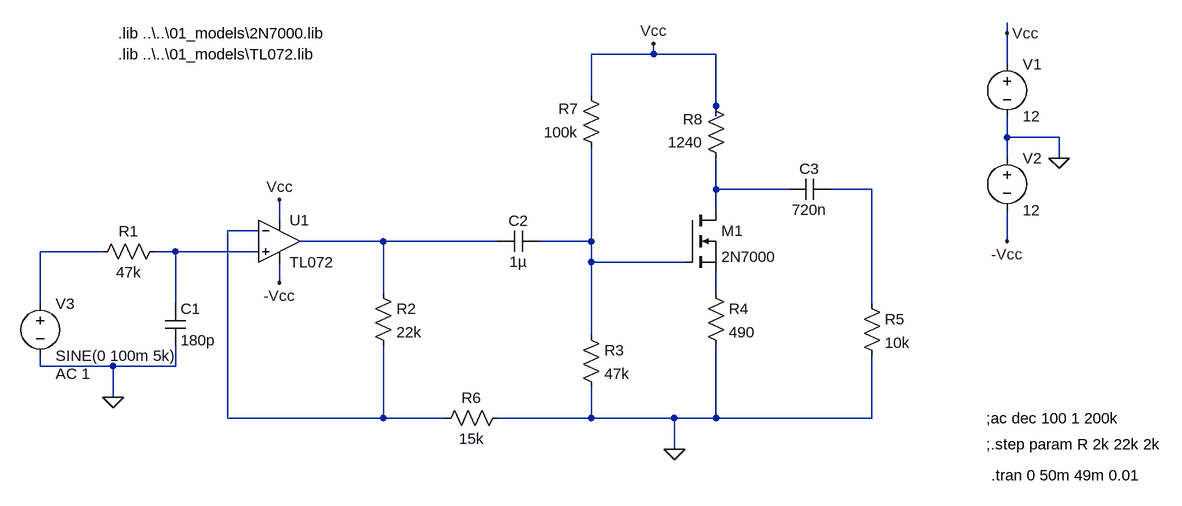
[diagram p0: schematic elec331_commonsourceamplifier.asc]
elec331_commonsourceamplifier.asc, the LTspice schematic file:
Version 4
SHEET 1 1932 884
WIRE 1648 -16 1648 -32
WIRE 1104 16 1104 0
WIRE 1104 16 1008 16
WIRE 1200 16 1104 16
WIRE 1648 32 1648 -16
WIRE 1008 80 1008 16
WIRE 1200 96 1200 16
WIRE 1200 112 1200 96
WIRE 1648 144 1648 112
WIRE 1728 144 1648 144
WIRE 1648 176 1648 144
WIRE 1728 176 1728 144
WIRE 1200 224 1200 176
WIRE 1312 224 1200 224
WIRE 1440 224 1376 224
WIRE 1200 256 1200 224
WIRE 528 272 528 240
WIRE 496 288 448 288
WIRE 688 304 560 304
WIRE 864 304 688 304
WIRE 1008 304 1008 160
WIRE 1008 304 928 304
WIRE 1648 304 1648 256
WIRE 256 320 160 320
WIRE 368 320 336 320
WIRE 496 320 368 320
WIRE 1008 336 1008 304
WIRE 1152 336 1008 336
WIRE 528 368 528 336
WIRE 688 384 688 304
WIRE 1200 384 1200 352
WIRE 160 400 160 320
WIRE 368 400 368 320
WIRE 1440 400 1440 224
WIRE 1008 448 1008 336
WIRE 160 496 160 480
WIRE 272 496 160 496
WIRE 368 496 368 464
WIRE 368 496 272 496
WIRE 272 544 272 496
WIRE 448 576 448 288
WIRE 688 576 688 464
WIRE 688 576 448 576
WIRE 784 576 688 576
WIRE 1008 576 1008 528
WIRE 1008 576 864 576
WIRE 1136 576 1008 576
WIRE 1200 576 1200 464
WIRE 1200 576 1136 576
WIRE 1440 576 1440 480
WIRE 1440 576 1200 576
WIRE 1136 624 1136 576
FLAG 1728 176 0
FLAG 1648 -16 Vcc
FLAG 1648 304 -Vcc
FLAG 272 544 0
FLAG 1136 624 0
FLAG 528 240 Vcc
FLAG 1104 0 Vcc
FLAG 528 368 -Vcc
SYMBOL res 240 336 R270
WINDOW 0 32 56 VTop 2
WINDOW 3 0 56 VBottom 2
SYMATTR InstName R1
SYMATTR Value 47k
SYMBOL res 672 368 R0
SYMATTR InstName R2
SYMATTR Value 22k
SYMBOL res 992 432 R0
SYMATTR InstName R3
SYMATTR Value 47k
SYMBOL res 1184 368 R0
SYMATTR InstName R4
SYMATTR Value 490
SYMBOL res 1424 384 R0
SYMATTR InstName R5
SYMATTR Value 10k
SYMBOL res 880 560 R90
WINDOW 0 0 56 VBottom 2
WINDOW 3 32 56 VTop 2
SYMATTR InstName R6
SYMATTR Value 15k
SYMBOL res 1024 176 R180
WINDOW 0 36 76 Left 2
WINDOW 3 36 40 Left 2
SYMATTR InstName R7
SYMATTR Value 100k
SYMBOL res 1216 192 R180
WINDOW 0 36 76 Left 2
WINDOW 3 36 40 Left 2
SYMATTR InstName R8
SYMATTR Value 1240
SYMBOL cap 352 400 R0
SYMATTR InstName C1
SYMATTR Value 180p
SYMBOL cap 928 288 R90
WINDOW 0 0 32 VBottom 2
WINDOW 3 32 32 VTop 2
SYMATTR InstName C2
SYMATTR Value 1µ
SYMBOL cap 1376 208 R90
WINDOW 0 0 32 VBottom 2
WINDOW 3 32 32 VTop 2
SYMATTR InstName C3
SYMATTR Value 720n
SYMBOL nmos 1152 256 R0
SYMATTR InstName M1
SYMATTR Value 2N7000
SYMBOL voltage 1648 16 R0
WINDOW 123 0 0 Left 2
WINDOW 39 0 0 Left 2
SYMATTR InstName V1
SYMATTR Value 12
SYMBOL voltage 1648 160 R0
WINDOW 123 0 0 Left 2
WINDOW 39 0 0 Left 2
SYMATTR InstName V2
SYMATTR Value 12
SYMBOL voltage 160 384 R0
WINDOW 123 24 124 Left 2
WINDOW 39 0 0 Left 2
SYMATTR Value2 AC 1
SYMATTR InstName V3
SYMATTR Value SINE(0 100m 5k)
SYMBOL Opamps\\opamp2 528 240 R0
SYMATTR InstName U1
SYMATTR Value TL072
TEXT 1616 576 Left 2 !;ac dec 100 1 200k
TEXT 1616 616 Left 2 !;.step param R 2k 22k 2k
TEXT 1624 664 Left 2 !.tran 0 50m 49m 0.01
TEXT 280 -16 Left 2 !.lib ..\\..\\01_models\\2N7000.lib
TEXT 280 16 Left 2 !.lib ..\\..\\01_models\\TL072.lib

The netlist it stands for:
* elec331_commonsourceamplifier.asc
R1 N006 N007 47k
R2 N004 N003 22k
R3 N005 0 47k
R4 N008 0 490
R5 N002 0 10k
R6 0 N003 15k
R7 N005 Vcc 100k
R8 N001 Vcc 1240
C1 N007 0 180p
C2 N005 N004 1µ
C3 N002 N001 720n
M1 N001 N005 N008 N008 2N7000
V1 Vcc 0 12
V2 0 -Vcc 12
V3 N006 0 SINE(0 100m 5k) AC 1
XU1 N007 N003 Vcc -Vcc N004 TL072  ; pins In+ In- V+ V- OUT
.model NMOS NMOS
.model PMOS PMOS
.lib standard.mos
;ac dec 100 1 200k
;.step param R 2k 22k 2k
.tran 0 50m 49m 0.01
.lib ..\..\01_models\2N7000.lib
.lib ..\..\01_models\TL072.lib
.backanno
.end